# EAGLE design sensor (EAGLE 4.11)
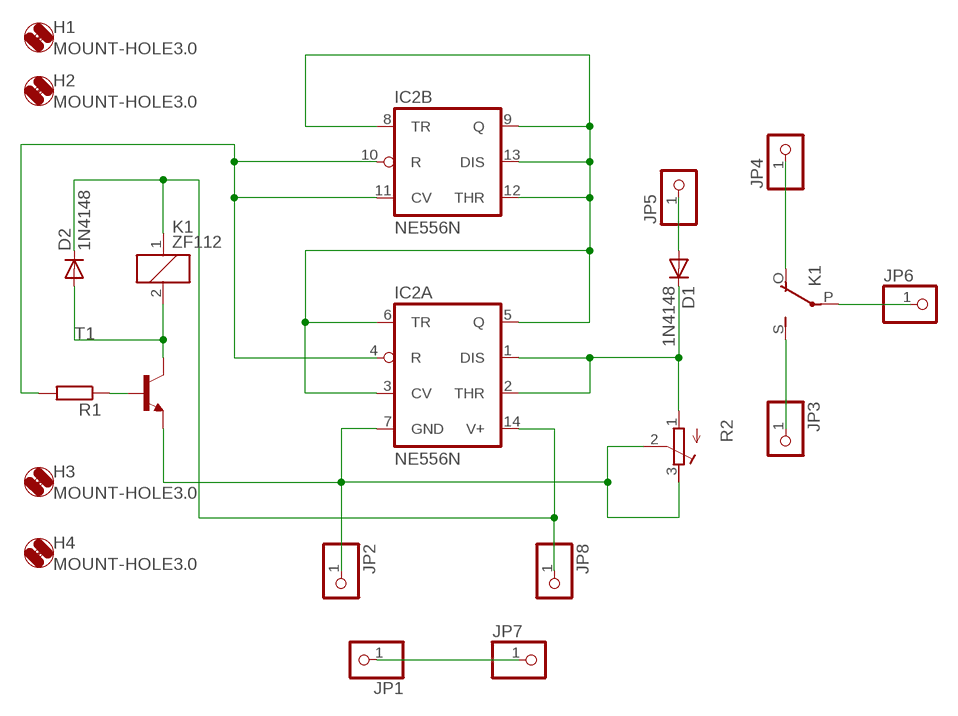
[diagram p0: schematic, sheet 1]

## Parts
D1  1N4148  [DO35-10]
D2  1N4148  [DO35-10]
H1  MOUNT-HOLE3.0  [3,0]
H2  MOUNT-HOLE3.0  [3,0]
H3  MOUNT-HOLE3.0  [3,0]
H4  MOUNT-HOLE3.0  [3,0]
IC2  NE556N  [DIL14]
JP1  PINHD-1X1  [1X01]
JP2  PINHD-1X1  [1X01]
JP3  PINHD-1X1  [1X01]
JP4  PINHD-1X1  [1X01]
JP5  PINHD-1X1  [1X01]
JP6  PINHD-1X1  [1X01]
JP7  PINHD-1X1  [1X01]
JP8  PINHD-1X1  [1X01]
K1  ZF112  [ZF112]
R1  R-EU_0309/10  [0309/10]
R2  R-TRIMM3339P  [RTRIM3339P]
T1  BC548C-NPN-TO92-EBC  [TO92-EBC]

## Nets
N$1: D1.C IC2.1(A:DIS) IC2.2(A:THR) R2.1(E)
N$3: D2.C IC2.14(A:V+) JP8.1 K1.1
N$4: IC2.3(A:CV) IC2.5(A:Q) IC2.6(A:TR) IC2.8(B:TR) IC2.9(B:Q) IC2.12(B:THR) IC2.13(B:DIS)
N$5: D1.A JP5.1
N$7: IC2.7(A:GND) JP2.1 R2.2(S) R2.3(A) T1.E
N$8: IC2.4(A:R) IC2.10(B:R) IC2.11(B:CV) R1.2
N$10: D2.A K1.2 T1.C
N$14: R1.1 T1.B
N$16: JP4.1 K1.O(2:O)
N$17: JP3.1 K1.S(2:S)
N$18: JP6.1 K1.P(2:P)
N$50: JP1.1 JP7.1

## Library data of the parts
D1 D2 = diode:1N4148: DIODE high speed (Philips)
H1-H4 = holes:MOUNT-HOLE: MOUNTING HOLE with drill center marker
IC2 = linear:*556: Dual TIMER
JP1-JP8 = pinhead:PINHD-1X1: PIN HEADER
K1 = relay:ZF112: RELAY 1 x switch
R1 = rcl:R-EU_: RESISTOR, European symbol
R2 = rcl:R-TRIMM: Trimm resistor
T1 = transistor:*-NPN-: NPN Transistror

## Board
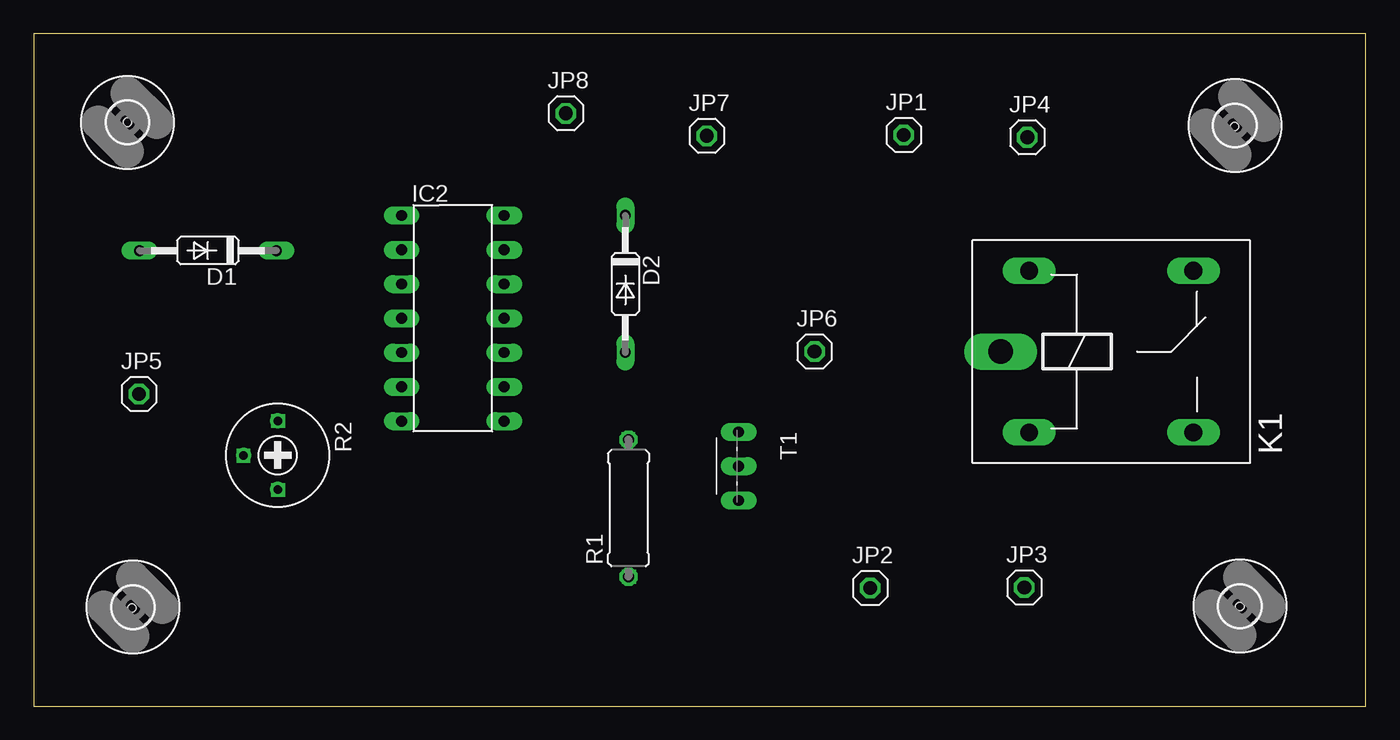
[diagram p1: board, top side]
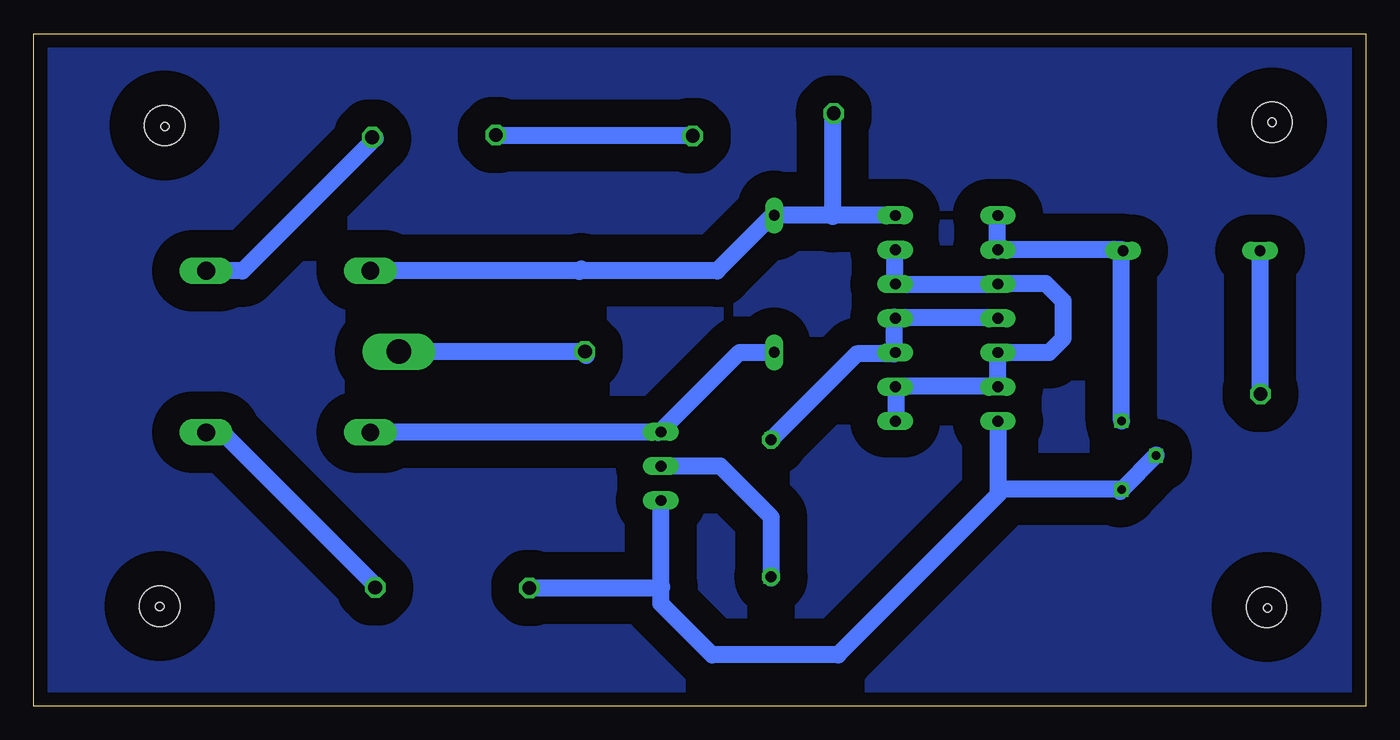
[diagram p2: board, bottom side, seen from below]

Size 98.81 x 49.86 mm. Coordinates in mm from the lower left corner, seen from the top.
Outline: 0,0 98.81,0 98.81,49.85 0,49.85 0,0
Copper layers 16: Bottom 0.035mm
Design rules "default": minimum track width 10mil, minimum drill 24mil, track to track 80mil, track to pad 80mil, pad to pad 80mil, via to via 80mil, smd to smd 80mil, copper to edge 40mil, drill to drill 8mil, minimum pad ring 10mil, minimum via ring 8mil, stop-mask expansion 4mil, vias tented up to drill 0mil, thermal gap 10mil
Holes 0.61 mm at 7.29,7.28 6.96,43.29 89.09,42.97 89.47,7.39

### Footprints (pad centres in the part's own frame; a part is rotated, then mirrored left to right if it is on the bottom)
DO35-10 = drill 0.813 long: A 5.08,0; C -5.08,0
3,0 = hole 3: 0,0
DIL14 = drill 0.813 long: 1 -7.62,-3.81; 2 -5.08,-3.81; 3 -2.54,-3.81; 4 0,-3.81; 5 2.54,-3.81; 6 5.08,-3.81; 7 7.62,-3.81; 8 7.62,3.81; 9 5.08,3.81; 10 2.54,3.81; 11 0,3.81; 12 -2.54,3.81; 13 -5.08,3.81; 14 -7.62,3.81
1X01 = drill 1.016 octagon: 1 0,0
ZF112 = drill 1.321 long: 1 -6.096,5.994; 2 -6.096,-5.994; O 6.096,5.994; S 6.096,-5.994 | drill 1.803 long: P -8.204,0
0309/10 = drill 0.813 octagon: 1 -5.08,0; 2 5.08,0
RTRIM3339P = drill 0.61 round: 1 -2.54,0; 2 0,-2.54; 3 2.54,0
TO92-EBC = drill 0.813 long: B 0,-1.27; C -2.54,-1.27; E 2.54,-1.27

### Placement (x,y rotation side)
D1  12.92,33.77 180 top
D2  43.88,31.3 270 top
H1  6.95,43.28 0 top
H2  89.47,7.41 0 top
H3  7.36,7.34 0 top
H4  89.1,43.05 0 top
IC2  31.09,28.76 270 top
JP1  64.54,42.34 0 top
JP2  62.05,8.75 0 top
JP3  73.48,8.79 0 top
JP4  73.7,42.18 0 top
JP5  7.81,23.14 0 top
JP6  57.92,26.29 0 top
JP7  49.93,42.29 0 top
JP8  39.47,43.95 0 top
K1  79.93,26.28 0 top
R1  44.12,14.67 90 top
R2  18.1,18.6 270 top
T1  53.56,17.78 270 top

### Tracks (layer width: path | path; a pad name or v marks a point on that pad's centre or on a via)
N$1
  Bottom 1.27: 18.12,33.77 18.12,33.59 | 18.12,33.77 D1.C | 18.12,33.84 IC2.2 27.31,33.84 | 18.12,33.84 18.12,33.77 | 27.31,33.84 27.31,33.8 | IC2.1 27.31,36.38 27.31,33.84 | 18.12,33.84 18.12,33.86 | R2.1 18.12,21.14 18.12,33.84
N$2
  pour Bottom: 0.63,0.47 0.63,49.72 98.6,49.72 98.6,0.47
N$3
  Bottom 1.27: 43.88,36.51 43.87,36.52 | 43.88,36.51 D2.C | 58.36,32.28 48.12,32.28 44.03,36.36 | 58.36,32.28 K1.1 | 44.03,36.36 43.88,36.51 | 44.03,36.36 43.87,36.2 43.7,36.38 39.53,36.38 | 44.03,36.36 | IC2.14 39.53,36.38 | 58.36,32.28 58.36,32.23 58.19,32.4 | 39.53,36.38 39.53,36.32 | JP8.1 39.53,43.95 39.53,36.38
N$4
  Bottom 1.27: 34.93,33.86 | 34.93,33.86 IC2.13 | 34.93,33.86 34.93,31.32 IC2.12 34.87,31.26 27.45,31.26 27.45,31.33 27.32,31.33 | 34.87,23.71 34.86,23.71 34.86,21.18 IC2.8 | 34.87,23.71 IC2.9 | 34.87,23.71 27.32,23.71 IC2.6 27.31,23.68 27.31,26.21 IC2.5 23.51,26.21 22.44,27.28 22.44,30.02 23.75,31.33 27.32,31.33 | 27.32,31.33 IC2.3
N$5
  Bottom 1.27: D1.A 7.83,23.14 JP5.1
N$6  (via drill 0.61)
  other vias: 73.69,42.16
N$7
  Bottom 1.27: 52.29,8.84 52.29,7.6 48.49,3.8 39.15,3.8 27.24,15.71 27.24,15.92 | 52.29,8.84 T1.E | IC2.7 27.24,21.18 27.24,15.92 | 18.1,16.05 18.23,15.92 | 18.1,16.05 R2.3 27.1,16.06 27.24,15.92 | R2.2 15.56,18.59 18.1,16.05 | 52.29,8.84 52.24,8.84 52.33,8.75 JP2.1
N$8
  Bottom 1.27: 35,28.85 35,28.86 | 35,28.85 IC2.11 | 35,28.79 35,26.31 IC2.10 35.01,26.11 37.75,26.11 R1.2 | 35,28.79 35,28.85 | IC2.4 27.32,28.79 35,28.79
N$9  (via drill 0.61)
  other vias: 39.49,43.97
N$10
  Bottom 1.27: K1.2 52.49,20.29 52.46,20.32 T1.C 52.35,20.32 | 52.35,20.32 | D2.A 46.45,26.22 52.35,20.32
N$11  (via drill 0.61)
  other vias: 86.03,32.29
N$12  (via drill 0.61)
  other vias: 73.85,32.29
N$13  (via drill 0.61)
  other vias: 86.03,20.32
N$14
  Bottom 1.27: T1.B 47.88,17.78 44.09,13.99 44.09,9.48 44.12,9.52 R1.1
N$15  (via drill 0.61)
  other vias: 73.85,20.32
N$16
  Bottom 1.27: JP4.1 73.56,42.18 73.49,42.1 83.31,32.28 K1.O
N$17
  Bottom 1.27: JP3.1 73.43,8.79 73.38,8.84 84.83,20.29 K1.S
N$18
  Bottom 1.27: 57.92,26.11 57.82,26.01 | JP6.1 57.92,26.11 | K1.P 58.1,26.28 57.92,26.11
N$19  (via drill 0.61)
  other vias: 71.7,26.33
N$20  (via drill 0.61)
  other vias: 57.91,26.28
N$21  (via drill 0.61)
  other vias: 73.53,8.79
N$22  (via drill 0.61)
  other vias: 62.04,8.73
N$23  (via drill 0.61)
  other vias: 52.27,15.23
N$24  (via drill 0.61)
  other vias: 52.27,17.8
N$25  (via drill 0.61)
  other vias: 52.32,20.32
N$26  (via drill 0.61)
  other vias: 44.11,19.79
N$27  (via drill 0.61)
  other vias: 44.16,9.59
N$28  (via drill 0.61)
  other vias: 43.95,26.23
N$29  (via drill 0.61)
  other vias: 43.9,36.37
N$30  (via drill 0.61)
  other vias: 34.93,36.37
N$31  (via drill 0.61)
  other vias: 34.93,33.79
N$32  (via drill 0.61)
  other vias: 34.93,31.27
N$33  (via drill 0.61)
  other vias: 34.93,28.75
N$34  (via drill 0.61)
  other vias: 34.93,26.17
N$35  (via drill 0.61)
  other vias: 34.93,23.65
N$36  (via drill 0.61)
  other vias: 34.93,21.13
N$37  (via drill 0.61)
  other vias: 27.31,21.13
N$38  (via drill 0.61)
  other vias: 27.31,23.65
N$39  (via drill 0.61)
  other vias: 27.25,26.23
N$40  (via drill 0.61)
  other vias: 27.31,28.75
N$41  (via drill 0.61)
  other vias: 27.31,31.27
N$42  (via drill 0.61)
  other vias: 27.31,33.85
N$43  (via drill 0.61)
  other vias: 27.31,36.42
N$44  (via drill 0.61)
  other vias: 18.02,33.79
N$45  (via drill 0.61)
  other vias: 18.13,21.13
N$46  (via drill 0.61)
  other vias: 15.55,18.55
N$47  (via drill 0.61)
  other vias: 18.13,16.03
N$48  (via drill 0.61)
  other vias: 7.82,23.12
N$49  (via drill 0.61)
  other vias: 7.82,33.79
N$50
  Bottom 1.27: 64.57,42.34 64.57,42.43 | 64.57,42.34 JP1.1 | JP7.1 64.57,42.29 64.57,42.34
N$51  (via drill 0.61)
  other vias: 49.95,42.3
N$52  (via drill 0.61)
  other vias: 64.56,42.35